# Altium project STK672-080.PrjPCB
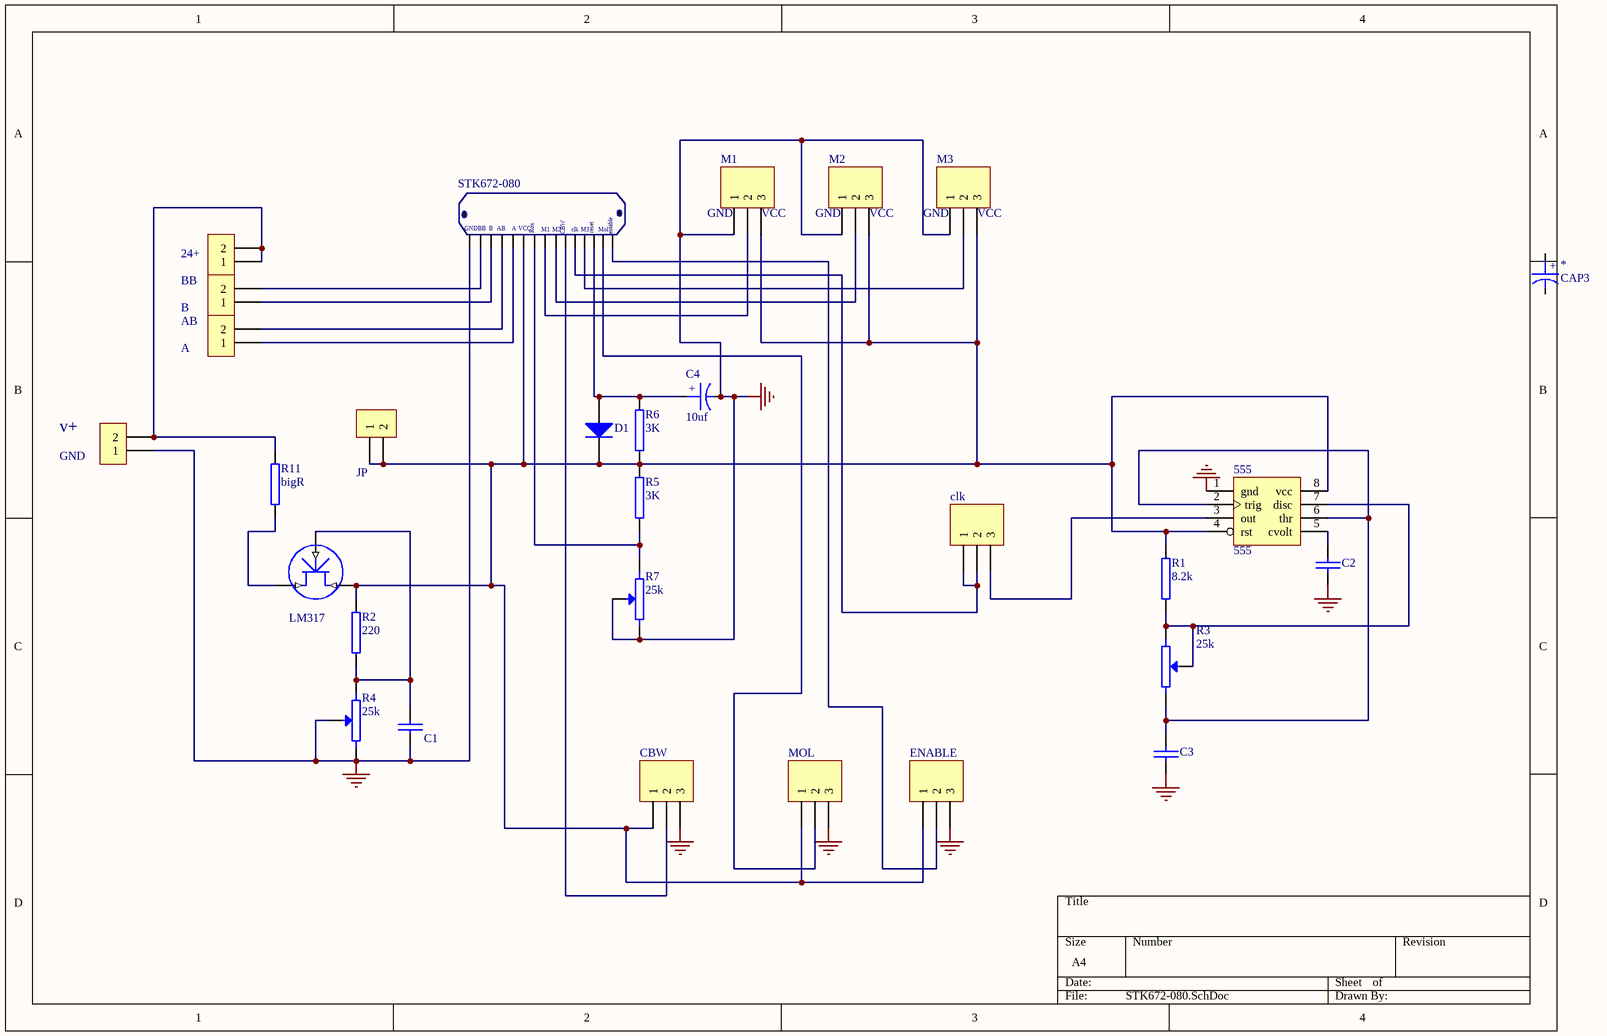
[diagram p0: STK672-080.SchDoc]
1 sheet, 29 parts. Net scope: global (net labels, ports and power ports of the same name join across sheets).
Board file: STK672-080.PcbDoc

## Sheet STK672-080.SchDoc
size A4

### Parts
24+  POWER  [POWERPF]  (value not drawn)
555  555  [DIP8]
*  CAP3  [CAP3]
C1  15p  [RAD0.3]  (value not drawn)
C2  15p  [RAD0.3]  (value not drawn)
C3  15p  [RAD0.3]  (value not drawn)
C4  10uf  [cap2]
CBW  Header 3  [HDR1X3]  (value not drawn)
clk  Header 3  [HDR1X3]  (value not drawn)
D1  Diode 1N4007  [DO-41]  (value not drawn)
ENABLE  Header 3  [HDR1X3]  (value not drawn)
J2  POWER  [POWERPF]  (value not drawn)
J3  POWER  [POWERPF]  (value not drawn)
JP  TESTPOINT  [tp]  (value not drawn)
LM317  JFET N  [TO-221]  (value not drawn)
M1  Header 3  [HDR1X3]  (value not drawn)
M2  Header 3  [HDR1X3]  (value not drawn)
M3  Header 3  [HDR1X3]  (value not drawn)
MOL  Header 3  [HDR1X3]  (value not drawn)
POWER  POWER  [POWERPF]  (value not drawn)
R1  8.2k  [AXIAL0.4]
R2  220  [AXIAL0.4]
R3  25k  [SIP3-D]
R4  25k  [SIP3-D]
R5  3K  [AXIAL0.4]
R6  3K  [AXIAL0.4]
R7  25k  [SIP3-D]
R11  bigR  [bigRPF]
STK672-080  1  [STK672-080PF]  (value not drawn)

### Nets
GND: 555.1(gnd) C1.2 C2.2 C3.2 C4.2 CBW.3 ENABLE.3 M1.1 M2.1 M3.1 MOL.3 POWER.1 R4.1 R4.3(W) R7.1 R7.3(W) STK672-080.1(VCC)
Net24+_1: 24+.1 24+.2 POWER.2 R11.2
Net555_2: 555.2(trig) 555.6(thr) C3.1 R3.2
Net555_3: 555.3(out) clk.3
Net555_4: 555.4(rst) 555.8(vcc) CBW.1 D1.2(K) ENABLE.1 JP.1 JP.2 LM317.2(D) M1.3 M2.3 M3.3 MOL.1 R1.2 R2.2 R5.2 R6.1 STK672-080.6(VCC)
Net555_5: 555.5(cvolt) C2.1
Net555_7: 555.7(disc) R1.1 R3.1 R3.3(W)
NetC1_1: C1.1 LM317.1(G) R2.1 R4.2
NetC4_1: C4.1 D1.1(A) R6.2 STK672-080.13(RESET)
NetCBW_2: CBW.2 STK672-080.10(CBW)
Netclk_1: clk.1 clk.2 STK672-080.11(CLK)
NetENABLE_2: ENABLE.2 STK672-080.15
NetJ2_1: J2.1 STK672-080.3(B)
NetJ2_2: J2.2 STK672-080.2(BB)
NetJ3_1: J3.1 STK672-080.5(A)
NetJ3_2: J3.2 STK672-080.4(AB)
NetLM317_3: LM317.3(S) R11.1
NetM1_2: M1.2 STK672-080.8(M1)
NetM2_2: M2.2 STK672-080.9(M2)
NetM3_2: M3.2 STK672-080.12(M3)
NetMOL_2: MOL.2 STK672-080.14
NetR5_1: R5.1 R7.2 STK672-080.7(Rox)

Not connected (* = marked no-connect by the designer): * 1 2

### Notes on the sheet
- (near M1) GND
- (near M1) VCC
- (near M2) GND
- (near M2) VCC
- (near M3) GND
- (near M3) VCC
- BB
- B
- AB
- A
- (near POWER) v+
- (near POWER) GND
- (in symbol CAP3) +
- (in symbol CAPACITOR POL) +
- (in symbol STK672-080) GND; clk; reset; Mol; entable

### Library data of the parts
C1-C3 = CAP: Capacitor
C4 = CAPACITOR POL: Capacitor
CBW clk ENABLE M1-M3 MOL = Header 3: Header, 3-Pin; LatestRevisionDate: 17-Jul-2002; LatestRevisionNote: Re-released for DXP Platform.; Publisher: Altium Limited
D1 = Diode 1N4007: 1 Amp General Purpose Rectifier; Published: 8-Jun-2000; LatestRevisionDate: 17-Jul-2002; LatestRevisionNote: Re-released for DXP Platform.; DatasheetDocument: 1998; PackageDocument: Aug-1999; PackageReference: DO-41; Publisher: Altium Limited; Code_JEDEC: DO-204-AL; ComponentLink1Description: Manufacturer Link; ComponentLink1URL: http://www.fairchildsemi.com/; ComponentLink2Description: Datasheet; ComponentLink2URL: http://www.fairchildsemi.com/ds/1N%2F1N4001.pdf
R1 R2 R5 R6 = RES2
R3 R4 R7 = POT2: Potentiometer
STK672-080 = STK672-080